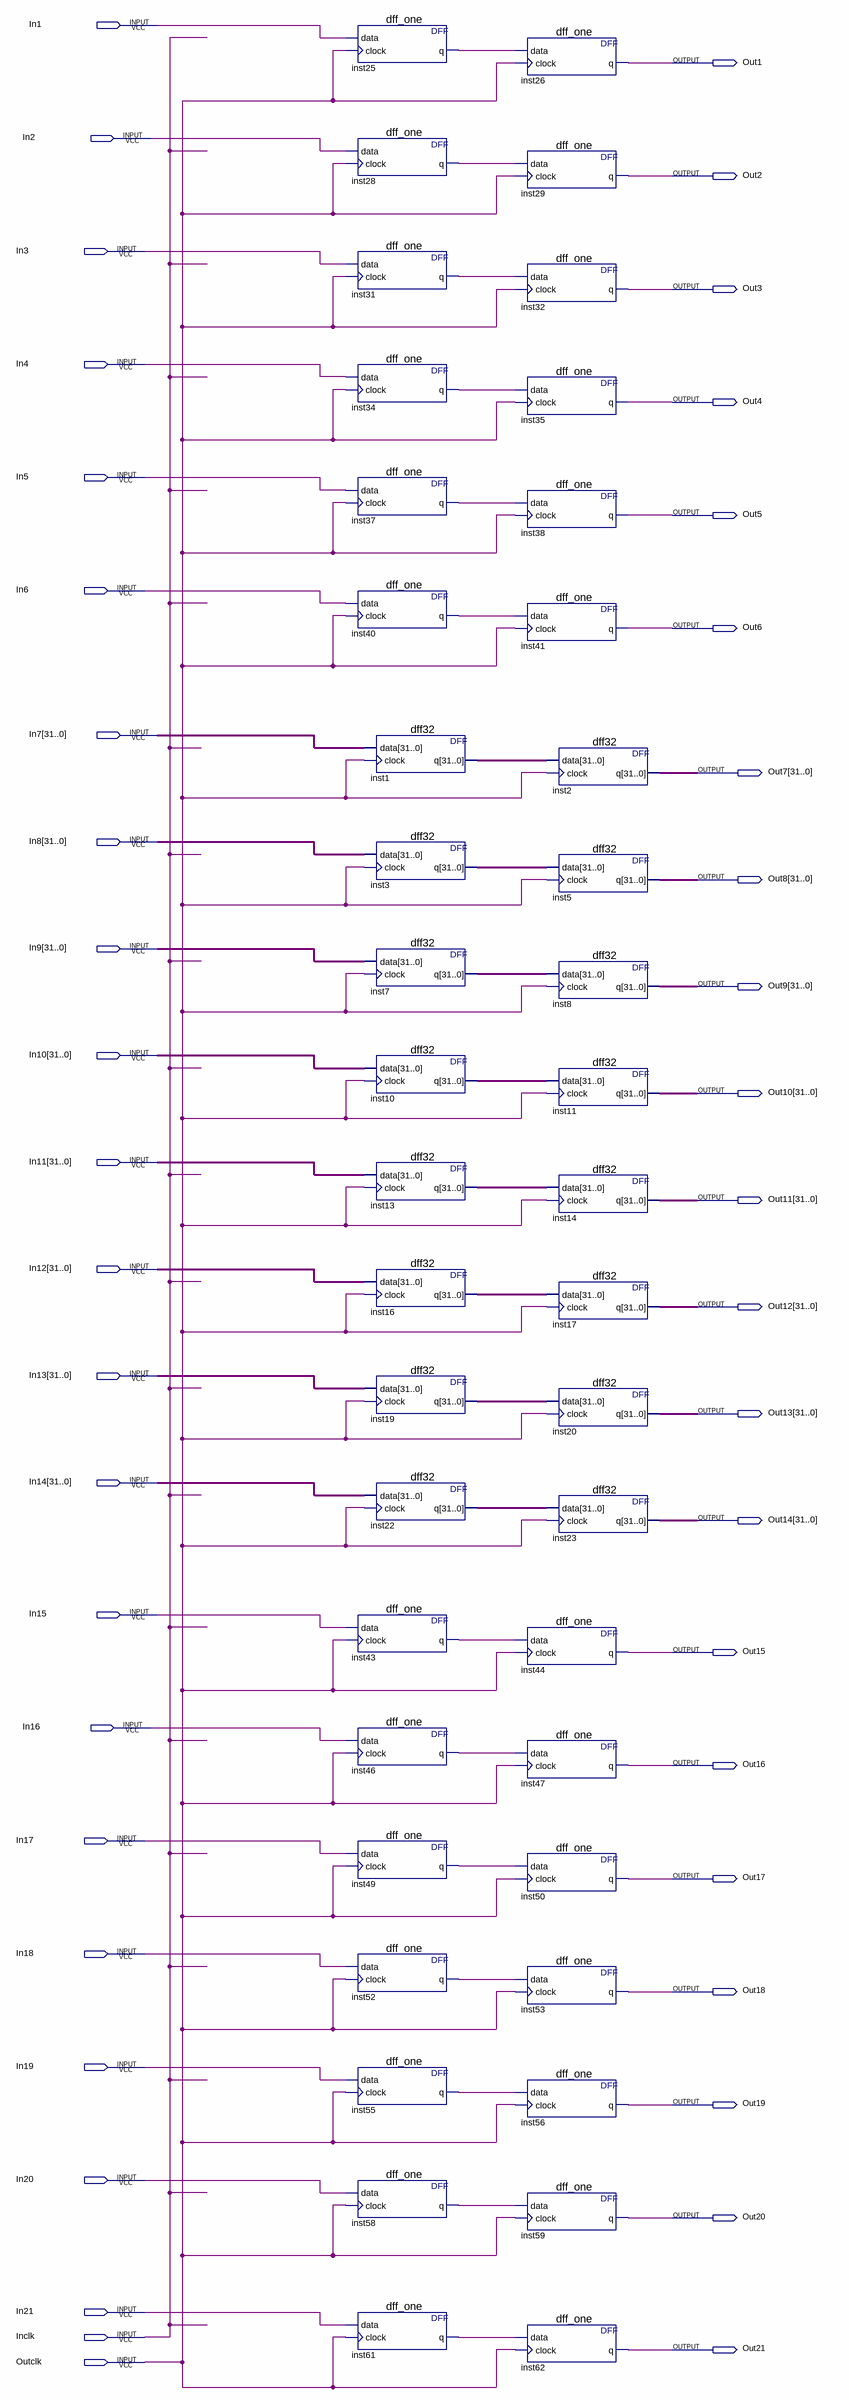
[diagram p0: schematic sheet]
// Quartus schematic VME_thing.bdf as structural Verilog: 42 symbols, 44 pins
module VME_thing (
  input  In1,
  input  In2,
  input  In3,
  input  In4,
  input  In5,
  input  In6,
  input  [31:0] In7,
  input  [31:0] In8,
  input  [31:0] In9,
  input  [31:0] In10,
  input  [31:0] In11,
  input  [31:0] In12,
  input  [31:0] In13,
  input  [31:0] In14,
  input  In15,
  input  In16,
  input  In17,
  input  In18,
  input  In19,
  input  In20,
  input  In21,
  input  Inclk,
  input  Outclk,
  output Out1,
  output Out2,
  output Out3,
  output Out4,
  output Out5,
  output Out6,
  output [31:0] Out7,
  output [31:0] Out8,
  output [31:0] Out9,
  output [31:0] Out10,
  output [31:0] Out11,
  output [31:0] Out12,
  output [31:0] Out13,
  output [31:0] Out14,
  output Out15,
  output Out16,
  output Out17,
  output Out18,
  output Out19,
  output Out20,
  output Out21
);

  wire inst25_q, inst28_q, inst31_q, inst34_q, inst37_q, inst40_q, inst43_q, inst46_q, inst49_q, inst52_q,
       inst55_q, inst58_q, inst61_q;
  wire [31:0] inst1_q, inst3_q, inst7_q, inst10_q, inst13_q, inst16_q, inst19_q, inst22_q;

  dff_one inst25 (.data(In1), .clock(Outclk), .q(inst25_q));
  dff_one inst28 (.data(In2), .clock(Outclk), .q(inst28_q));
  dff_one inst31 (.data(In3), .clock(Outclk), .q(inst31_q));
  dff_one inst34 (.data(In4), .clock(Outclk), .q(inst34_q));
  dff_one inst37 (.data(In5), .clock(Outclk), .q(inst37_q));
  dff_one inst40 (.data(In6), .clock(Outclk), .q(inst40_q));
  dff32 inst1 (.data(In7), .clock(Outclk), .q(inst1_q));
  dff32 inst3 (.data(In8), .clock(Outclk), .q(inst3_q));
  dff32 inst7 (.data(In9), .clock(Outclk), .q(inst7_q));
  dff32 inst10 (.data(In10), .clock(Outclk), .q(inst10_q));
  dff32 inst13 (.data(In11), .clock(Outclk), .q(inst13_q));
  dff32 inst16 (.data(In12), .clock(Outclk), .q(inst16_q));
  dff32 inst19 (.data(In13), .clock(Outclk), .q(inst19_q));
  dff32 inst22 (.data(In14), .clock(Outclk), .q(inst22_q));
  dff_one inst43 (.data(In15), .clock(Outclk), .q(inst43_q));
  dff_one inst46 (.data(In16), .clock(Outclk), .q(inst46_q));
  dff_one inst49 (.data(In17), .clock(Outclk), .q(inst49_q));
  dff_one inst52 (.data(In18), .clock(Outclk), .q(inst52_q));
  dff_one inst55 (.data(In19), .clock(Outclk), .q(inst55_q));
  dff_one inst58 (.data(In20), .clock(Outclk), .q(inst58_q));
  dff_one inst61 (.data(In21), .clock(Outclk), .q(inst61_q));
  dff_one inst26 (.data(inst25_q), .clock(Outclk), .q(Out1));
  dff_one inst29 (.data(inst28_q), .clock(Outclk), .q(Out2));
  dff_one inst32 (.data(inst31_q), .clock(Outclk), .q(Out3));
  dff_one inst35 (.data(inst34_q), .clock(Outclk), .q(Out4));
  dff_one inst38 (.data(inst37_q), .clock(Outclk), .q(Out5));
  dff_one inst41 (.data(inst40_q), .clock(Outclk), .q(Out6));
  dff_one inst44 (.data(inst43_q), .clock(Outclk), .q(Out15));
  dff_one inst47 (.data(inst46_q), .clock(Outclk), .q(Out16));
  dff_one inst50 (.data(inst49_q), .clock(Outclk), .q(Out17));
  dff_one inst53 (.data(inst52_q), .clock(Outclk), .q(Out18));
  dff_one inst56 (.data(inst55_q), .clock(Outclk), .q(Out19));
  dff_one inst59 (.data(inst58_q), .clock(Outclk), .q(Out20));
  dff_one inst62 (.data(inst61_q), .clock(Outclk), .q(Out21));
  dff32 inst2 (.data(inst1_q), .clock(Outclk), .q(Out7));
  dff32 inst5 (.data(inst3_q), .clock(Outclk), .q(Out8));
  dff32 inst8 (.data(inst7_q), .clock(Outclk), .q(Out9));
  dff32 inst11 (.data(inst10_q), .clock(Outclk), .q(Out10));
  dff32 inst14 (.data(inst13_q), .clock(Outclk), .q(Out11));
  dff32 inst17 (.data(inst16_q), .clock(Outclk), .q(Out12));
  dff32 inst20 (.data(inst19_q), .clock(Outclk), .q(Out13));
  dff32 inst23 (.data(inst22_q), .clock(Outclk), .q(Out14));
endmodule
